# Altium project HIVE_SIGHT.PrjPcb (part 1 of 4)
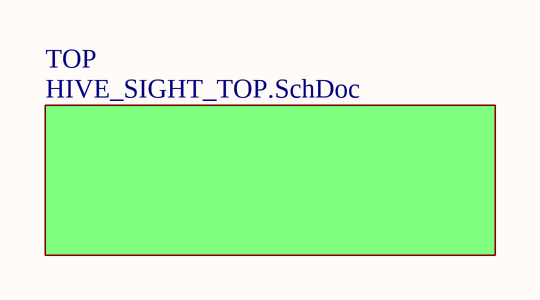
[diagram p0: HIVE_SIGHT_TITLE.SchDoc]
Project_Stencil_Top_Thickness: 0.1 MM; Project_Stencil_Bot_Thickness: 0.1 MM; Project_Revision: 1.000; Project_Name: HiveSight; Project_Group: SwarmUS; Project_Global: PMC; Project_Designer3: Louis-Daniel Gaulin; Project_Designer2: Hubert Dube; Project_Designer1: Philippe Arsenault; Project_Date: 2020-07-13
10 sheets, 273 parts. Net scope: hierarchical (ports join the sheet entries above them; power ports are global).
Board files: HIVE_SIGHT.PcbDoc, HIVE_SIGHT _PANEL.PcbDoc
Sheets:
  HIVE_SIGHT_TITLE.SchDoc
    TOP = HIVE_SIGHT_TOP.SchDoc
      POWER = HIVE_SIGHT_POWER.SchDoc
      USB = HIVE_SIGHT_USB.SchDoc
      DECAWAVE = HIVE_SIGHT_DECAWAVE_A.SchDoc
      WIRELESS = HIVE_SIGHT_WIRELESS.SchDoc
      DECAWAVE = HIVE_SIGHT_DECAWAVE_B.SchDoc
      MISC = HIVE_SIGHT_MISC.SchDoc
      NUCLEO = HIVE_SIGHT_NUCLEO.SchDoc
      WROOM = HIVE_SIGHT_WROOM.SchDoc

## Sheet HIVE_SIGHT_TITLE.SchDoc
size Tabloid; DocumentNumber: 1; SheetNumber: 2; SheetTotal: 6; Sheet_Name: Insert name in Document Parameters; Size: 11x17

### Sub-sheets
TOP = HIVE_SIGHT_TOP.SchDoc: no entries

### Notes on the sheet
- Revision history
- Package size conversion
- Metric
- 1005
- 1608
- Imperial
- 0402
- 0603
- Revision
- 2012
- 3216
- 0805
- 1206
- 3225
- 6432
- 1210
- 2512
- Date :
- Project Title
- Global Project
- Size
- Date
- Group
- Sheet
- of
- Filename
- Designers

## Sheet HIVE_SIGHT_TOP.SchDoc
size Tabloid; SheetNumber: 3; SheetTotal: 6; Sheet_Name: Top; Size: 11x17
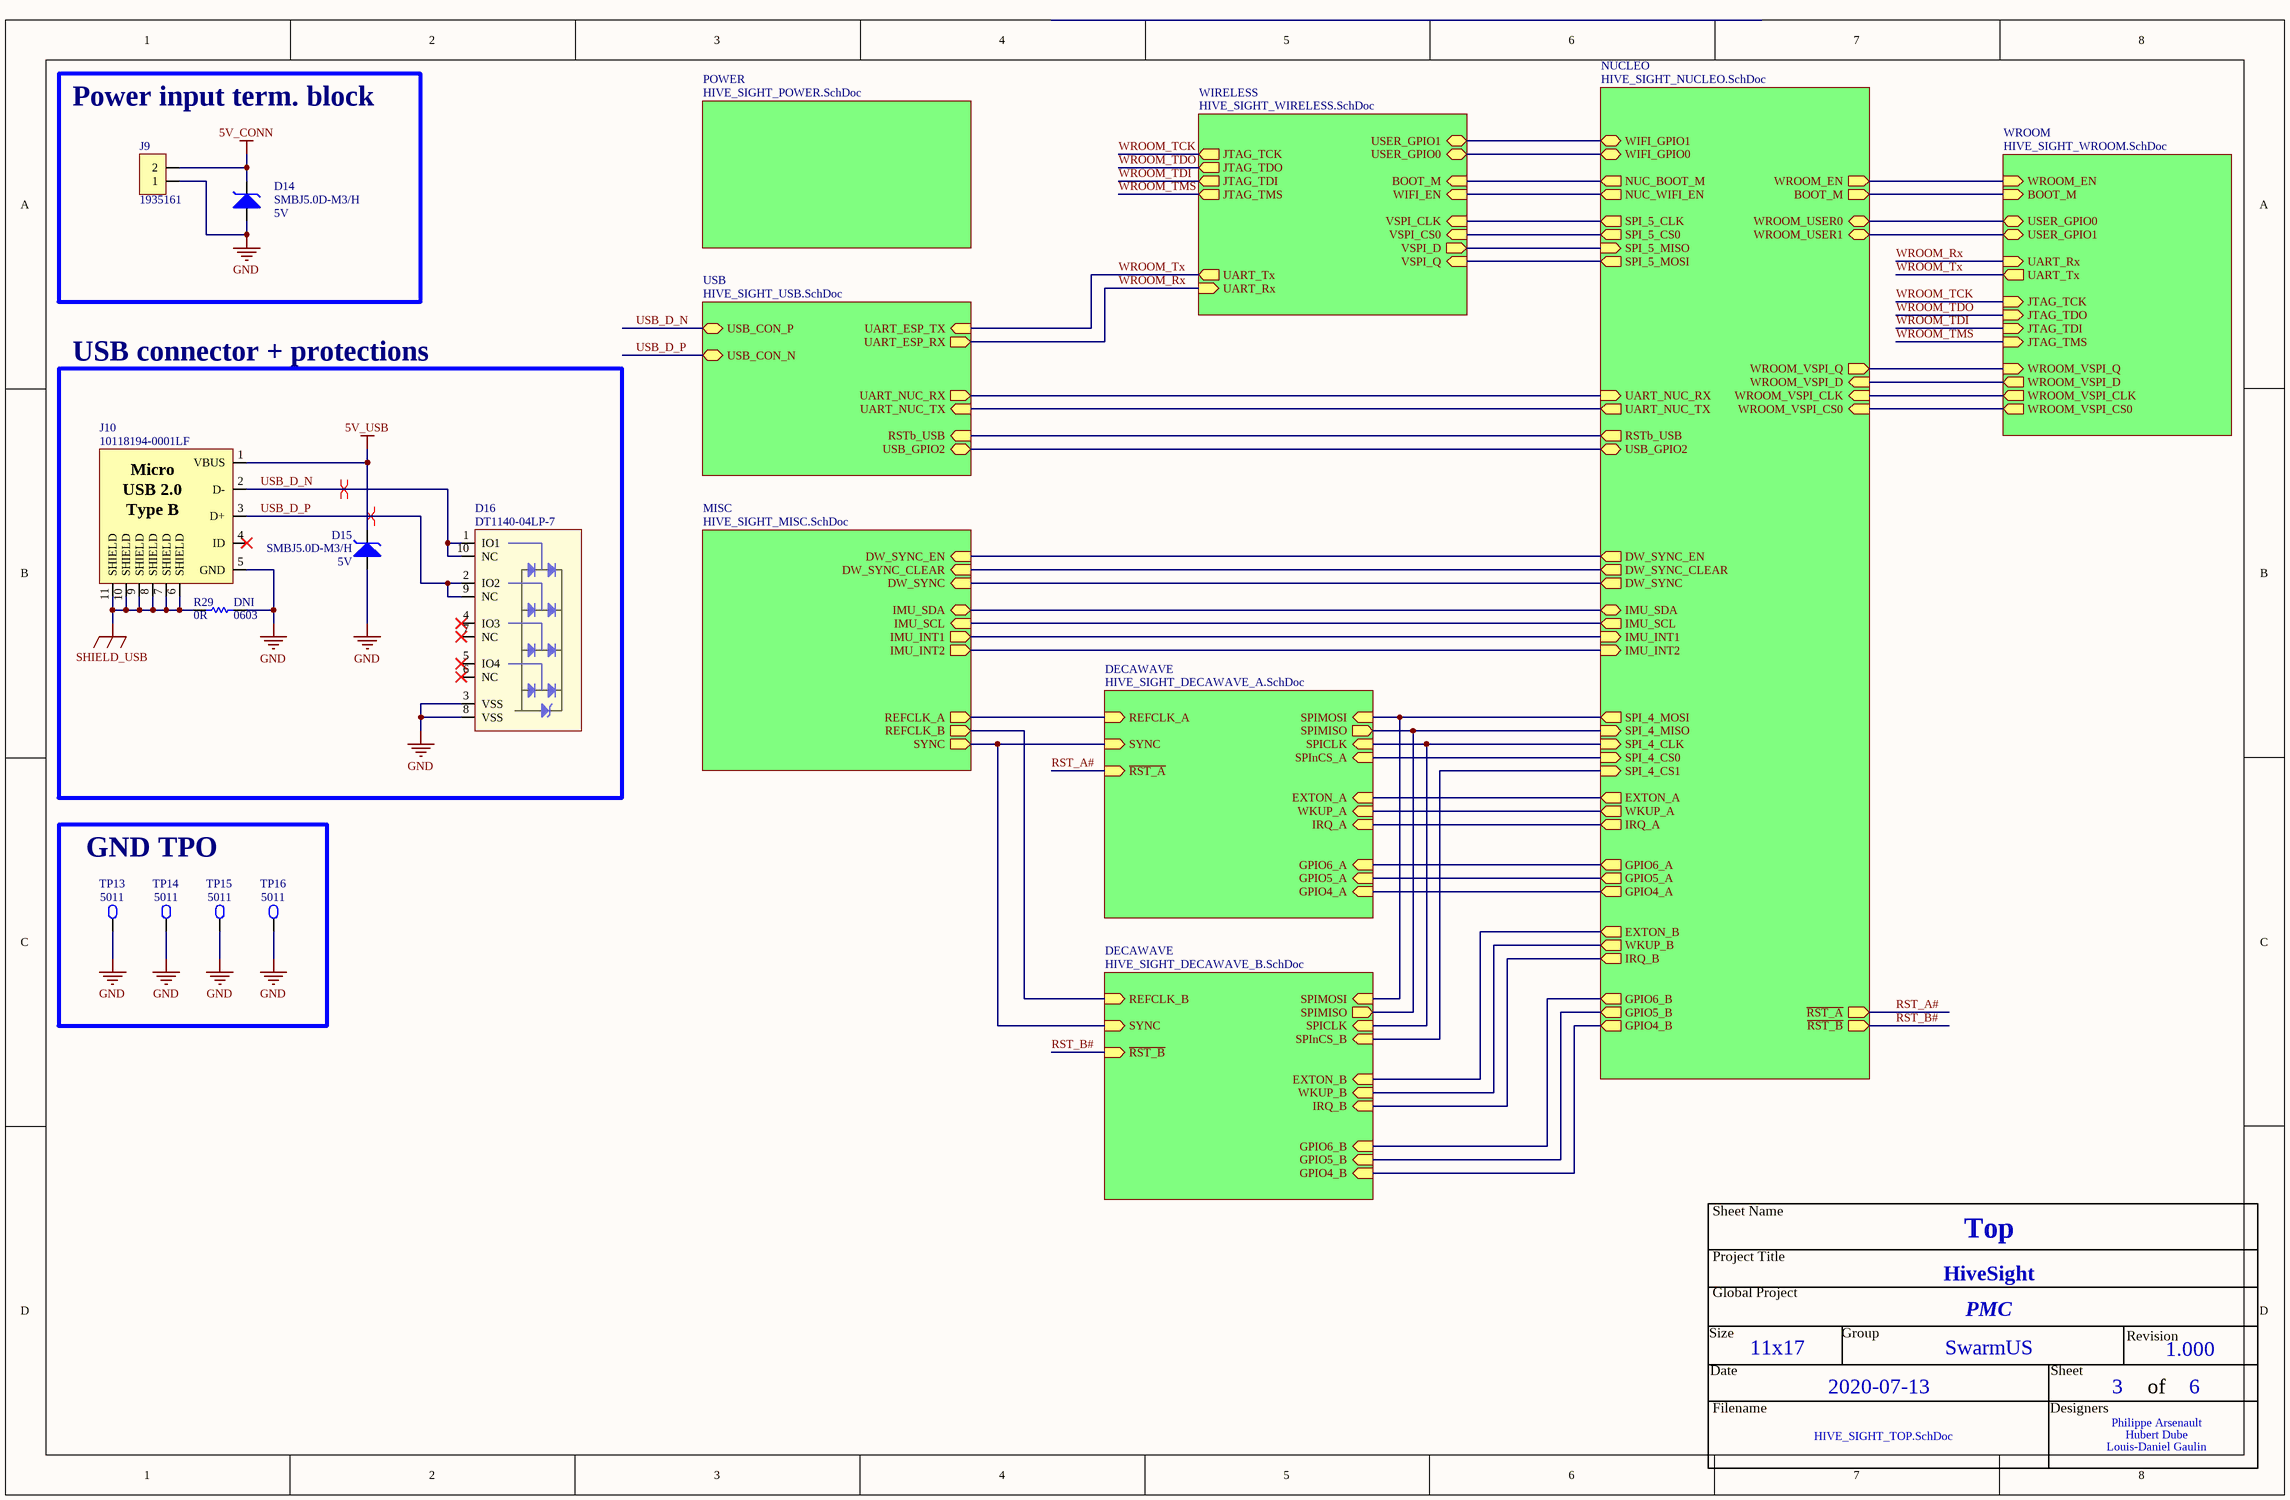
[diagram p1: HIVE_SIGHT_TOP.SchDoc]

### Parts
D14  SMBJ5.0D-M3/H  value 5V  [TVS_SMBJ5.0D-M3/H]
D15  SMBJ5.0D-M3/H  value 5V  [TVS_SMBJ5.0D-M3/H]
D16  DT1140-04LP-7  [TVS_DATA_DT1140-04LP-7]
J9  1935161  [CON_ 1935161]
J10  10118194-0001LF  [CON_USB_10118194-0001LF]
R29  value 0R  Assembly Note: DNI  Package: 0603  [RES_0603]  (hidden comment: RC0603JR-070RL)
TP13  5011  [TPO_5011]
TP14  5011  [TPO_5011]
TP15  5011  [TPO_5011]
TP16  5011  [TPO_5011]

### Blocks framed on the sheet
Power input term. block: D14 J9
USB connector + protections: D15 D16 J10 R29
GND TPO: TP13-TP16

### Sub-sheets
DECAWAVE = HIVE_SIGHT_DECAWAVE_A.SchDoc: SPInCS_A (in), SPIMOSI (in), SPIMISO (out), SPICLK (in), WKUP_A (in), IRQ_A (in), SYNC (in), REFCLK_A (in), ~{RST_A} (in), GPIO4_A (in), GPIO5_A (in), GPIO6_A (in), EXTON_A (in)
DECAWAVE = HIVE_SIGHT_DECAWAVE_B.SchDoc: SPInCS_B (in), SPIMOSI (in), SPICLK (in), WKUP_B (in), IRQ_B (in), REFCLK_B (in), ~{RST_B} (in), SYNC (in), GPIO4_B (in), GPIO5_B (in), GPIO6_B (in), EXTON_B (in), SPIMISO (out)
MISC = HIVE_SIGHT_MISC.SchDoc: IMU_INT2 (out), IMU_INT1 (out), IMU_SDA (bidir), IMU_SCL (in), REFCLK_A (out), REFCLK_B (out), SYNC (out), DW_SYNC_EN (in), DW_SYNC_CLEAR (in), DW_SYNC (in)
NUCLEO = HIVE_SIGHT_NUCLEO.SchDoc: IMU_INT2 (in), IMU_SDA (bidir), IMU_INT1 (in), IMU_SCL (out), SPI_4_CLK (in), SPI_4_CS1 (in), SPI_4_MOSI (out), SPI_4_CS0 (in), SPI_4_MISO (in), EXTON_A (out), WKUP_A (out), IRQ_A (out), GPIO6_A (out), GPIO5_A (out), GPIO4_A (out), EXTON_B (out), WKUP_B (out), IRQ_B (out), GPIO6_B (out), GPIO5_B (out), GPIO4_B (out), DW_SYNC_EN (out), DW_SYNC_CLEAR (out), DW_SYNC (out), ~{RST_A} (out), ~{RST_B} (out), UART_NUC_RX (in), UART_NUC_TX (out), RSTb_USB (out), USB_GPIO2 (bidir), SPI_5_MISO (in), SPI_5_CLK (out), SPI_5_CS0 (out), SPI_5_MOSI (out), NUC_BOOT_M (out), NUC_WIFI_EN (out), WIFI_GPIO1 (bidir), WIFI_GPIO0 (bidir), WROOM_EN (out), WROOM_VSPI_CS0 (in), WROOM_VSPI_CLK (in), WROOM_USER0 (bidir), WROOM_VSPI_D (in), WROOM_USER1 (bidir), BOOT_M (out), WROOM_VSPI_Q (out)
POWER = HIVE_SIGHT_POWER.SchDoc: no entries
USB = HIVE_SIGHT_USB.SchDoc: UART_NUC_TX (in), USB_CON_P (bidir), UART_ESP_TX (in), UART_NUC_RX (out), USB_CON_N (bidir), UART_ESP_RX (out), USB_GPIO2 (bidir), RSTb_USB (in)
WIRELESS = HIVE_SIGHT_WIRELESS.SchDoc: WIFI_EN (in), VSPI_CS0 (in), UART_Rx (in), VSPI_Q (in), VSPI_CLK (in), VSPI_D (out), BOOT_M (in), UART_Tx (out), USER_GPIO0 (bidir), USER_GPIO1 (bidir), JTAG_TMS (out), JTAG_TCK (out), JTAG_TDI (out), JTAG_TDO (out)
WROOM = HIVE_SIGHT_WROOM.SchDoc: WROOM_EN (in), WROOM_VSPI_CS0 (out), JTAG_TMS (in), WROOM_VSPI_CLK (out), JTAG_TCK (in), UART_Tx (out), JTAG_TDI (in), JTAG_TDO (in), USER_GPIO0 (bidir), WROOM_VSPI_D (out), USER_GPIO1 (bidir), UART_Rx (in), BOOT_M (in), WROOM_VSPI_Q (in)

### Nets
5V_CONN: D14.2(K) J9.2
5V_USB: D15.2(K) J10.1(VBUS)
GND: D14.1(A) D15.1(A) D16.3(VSS) D16.8(VSS) J9.1 J10.5(GND) R29.1 TP13.1 TP14.1 TP15.1 TP16.1
SHIELD_USB: J10.6(SHIELD) J10.7(SHIELD) J10.8(SHIELD) J10.9(SHIELD) J10.10(SHIELD) J10.11(SHIELD) R29.2
IMU_INT1: sheet MISC/IMU_INT1, sheet NUCLEO/IMU_INT1
IMU_INT2: sheet MISC/IMU_INT2, sheet NUCLEO/IMU_INT2
IMU_SCL: sheet MISC/IMU_SCL, sheet NUCLEO/IMU_SCL
IMU_SDA: sheet MISC/IMU_SDA, sheet NUCLEO/IMU_SDA
RST_A#: sheet DECAWAVE/~{RST_A}, sheet NUCLEO/~{RST_A}
RST_B#: sheet DECAWAVE/~{RST_B}, sheet NUCLEO/~{RST_B}
USB_D_N: D16.1(IO1) D16.10(NC) J10.2(D-) ; sheet USB/USB_CON_P
USB_D_P: D16.2(IO2) D16.9(NC) J10.3(D+) ; sheet USB/USB_CON_N
VSPI_CLK: sheet WIRELESS/VSPI_CLK, sheet NUCLEO/SPI_5_CLK
VSPI_CS0: sheet WIRELESS/VSPI_CS0, sheet NUCLEO/SPI_5_CS0
VSPI_D: sheet WIRELESS/VSPI_D, sheet NUCLEO/SPI_5_MISO
VSPI_Q: sheet WIRELESS/VSPI_Q, sheet NUCLEO/SPI_5_MOSI
WROOM_Rx: sheet USB/UART_ESP_RX, sheet WIRELESS/UART_Rx, sheet WROOM/UART_Rx
WROOM_TCK: sheet WIRELESS/JTAG_TCK, sheet WROOM/JTAG_TCK
WROOM_TDI: sheet WIRELESS/JTAG_TDI, sheet WROOM/JTAG_TDI
WROOM_TDO: sheet WIRELESS/JTAG_TDO, sheet WROOM/JTAG_TDO
WROOM_TMS: sheet WIRELESS/JTAG_TMS, sheet WROOM/JTAG_TMS
WROOM_Tx: sheet USB/UART_ESP_TX, sheet WIRELESS/UART_Tx, sheet WROOM/UART_Tx
NetC65_1: sheet DECAWAVE/REFCLK_A, sheet MISC/REFCLK_A
NetC66_1: sheet DECAWAVE/REFCLK_B, sheet MISC/REFCLK_B
NetR38_2: sheet WIRELESS/WIFI_EN, sheet NUCLEO/NUC_WIFI_EN
NetR40_2: sheet USB/RSTb_USB, sheet NUCLEO/RSTb_USB
NetR46_2: sheet NUCLEO/WROOM_EN, sheet WROOM/WROOM_EN
NetU3_21: sheet DECAWAVE/EXTON_A, sheet NUCLEO/EXTON_A
NetU3_23: sheet DECAWAVE/WKUP_A, sheet NUCLEO/WKUP_A
NetU3_24: sheet DECAWAVE/SPInCS_A, sheet NUCLEO/SPI_4_CS0
NetU3_29: sheet DECAWAVE/SYNC, sheet DECAWAVE/SYNC, sheet MISC/SYNC
NetU3_30: sheet DECAWAVE/GPIO6_A, sheet NUCLEO/GPIO6_A
NetU3_33: sheet DECAWAVE/GPIO5_A, sheet NUCLEO/GPIO5_A
NetU3_34: sheet DECAWAVE/GPIO4_A, sheet NUCLEO/GPIO4_A
NetU3_39: sheet DECAWAVE/SPIMOSI, sheet DECAWAVE/SPIMOSI, sheet NUCLEO/SPI_4_MOSI
NetU3_40: sheet DECAWAVE/SPIMISO, sheet DECAWAVE/SPIMISO, sheet NUCLEO/SPI_4_MISO
NetU3_41: sheet DECAWAVE/SPICLK, sheet DECAWAVE/SPICLK, sheet NUCLEO/SPI_4_CLK
NetU3_45: sheet DECAWAVE/IRQ_A, sheet NUCLEO/IRQ_A
NetU4_21: sheet DECAWAVE/EXTON_B, sheet NUCLEO/EXTON_B
NetU4_23: sheet DECAWAVE/WKUP_B, sheet NUCLEO/WKUP_B
NetU4_24: sheet DECAWAVE/SPInCS_B, sheet NUCLEO/SPI_4_CS1
NetU4_30: sheet DECAWAVE/GPIO6_B, sheet NUCLEO/GPIO6_B
NetU4_33: sheet DECAWAVE/GPIO5_B, sheet NUCLEO/GPIO5_B
NetU4_34: sheet DECAWAVE/GPIO4_B, sheet NUCLEO/GPIO4_B
NetU4_45: sheet DECAWAVE/IRQ_B, sheet NUCLEO/IRQ_B
NetU6_2: sheet MISC/DW_SYNC_EN, sheet NUCLEO/DW_SYNC_EN
NetU7_3: sheet MISC/DW_SYNC, sheet NUCLEO/DW_SYNC
NetU7_6: sheet MISC/DW_SYNC_CLEAR, sheet NUCLEO/DW_SYNC_CLEAR
NetU9_16: sheet WIRELESS/USER_GPIO1, sheet NUCLEO/WIFI_GPIO1
NetU9_23: sheet WIRELESS/BOOT_M, sheet NUCLEO/NUC_BOOT_M
NetU9_27: sheet WIRELESS/USER_GPIO0, sheet NUCLEO/WIFI_GPIO0
NetU11_12: sheet USB/USB_GPIO2, sheet NUCLEO/USB_GPIO2
NetU12_3: sheet USB/UART_NUC_RX, sheet NUCLEO/UART_NUC_RX
NetU12_7: sheet USB/UART_NUC_TX, sheet NUCLEO/UART_NUC_TX
NetU13_CN7-17: sheet NUCLEO/WROOM_VSPI_CS0, sheet WROOM/WROOM_VSPI_CS0
NetU13_CN8-6: sheet NUCLEO/WROOM_VSPI_CLK, sheet WROOM/WROOM_VSPI_CLK
NetU13_CN8-8: sheet NUCLEO/WROOM_VSPI_Q, sheet WROOM/WROOM_VSPI_Q
NetU13_CN8-10: sheet NUCLEO/WROOM_VSPI_D, sheet WROOM/WROOM_VSPI_D
NetU13_CN9-1: sheet NUCLEO/WROOM_USER1, sheet WROOM/USER_GPIO1
NetU13_CN9-2: sheet NUCLEO/BOOT_M, sheet WROOM/BOOT_M
NetU13_CN9-3: sheet NUCLEO/WROOM_USER0, sheet WROOM/USER_GPIO0

Not connected (* = marked no-connect by the designer): D16 4(IO3)* 5(IO4)* 6(NC)* 7(NC)*; J10 4(ID)*

### Layout directives
differential pair: USB_D_N, USB_D_P

### Notes on the sheet
- Sheet Name
- Project Title
- Global Project
- Revision
- Size
- Date
- Group
- Sheet
- of
- Filename
- Designers
- (in symbol CON_USB_10118194-0001LF) Micro; USB 2.0; Type B

### Library data of the parts
D14 D15 = TVS_SMBJ5.0D-M3/H: TVS - DIODE 5V 9.1V- DO-214AA; Manufacturer #1: Vishay Semiconductor Diodes Division; Current Rating: 65.9A peak pulse; GRAMS Lib Spec: 2.8c; Magnetic Material: Unknown; Polarized: Yes; Power Max: 600W peak pulse; Voltage Rating: Vbr = 6.5, Vc = 9.1; CreatedBy/Date: Louis-Daniel Gaulin / 27-02-2020; HelpURL: http://www.vishay.com/docs/87606/87606.pdf; Manufacturer #2: *; Package: DO-214AA; Part Number #1: SMBJ5.0D-M3/H; Part Number #2: *; Supplier 1: Digi-Key; Supplier Part Number 1: SMBJ5.0D-M3/HGICT-ND; Temperature: -55°C ~ 150°C; Tolerance: *; VerifiedBy: C.Paulin - 09/03/2020; Assembly Type: SMD
D16 = TVS_DATA_DT1140-04LP-7: TVS - DIODE 5.5V 10V - 10-UFDFN; Manufacturer #1: Diodes Incorporated; Value: 5.5V @ 1mA (Reverse Standoff); Voltage Rating: 6V (Breakdown); Current Rating: 6A (8/20µs); Power Max: 60W (8/20µs); GRAMS Lib Spec: 2.8; Note: Fooprint created from tpd4e05u06 (TI) for manufacturability (soldermask); Magnetic Material: Unknown; Polarized: Yes; Tolerance: -; HelpURL: https://www.diodes.com/assets/Datasheets/DT1140-04LP.pdf; CreatedBy/Date: Joël Lemay 2019-11-20; VerifiedBy: C.Paulin - 21/11/2019; Temperature: -55°C~85°C; Package: 10-UFDFN; Manufacturer #2: -; Assembly Type: SMD; Part Number #2: -; Part Number #1: DT1140-04LP-7; Supplier 1: Digi-Key; Supplier Part Number 1: DT1140-04LP-7DICT-ND; Cryo: UNKNOWN
J9 = CON_1935161: CON - TERM BLK 2POS SIDE ENTRY 5MM PCB - TH - 14-26 AWG; Manufacturer #1: Phoenix Contact; Current Rating: 17.5A; Magnetic Material: Unknown; Polarized: Yes; Voltage Rating: 400V; GRAMS Lib Spec: 2.8; Assembly Type: TH; Manufacturer #2: *; Note: *; Part Number #1: 1935161; Part Number #2: *; Package: TH; Power Max: *; Value: *; Temperature: -40 °C ~ 100 °C; HelpURL: https://media.digikey.com/pdf/Data%20Sheets/Phoenix%20Contact%20PDFs/1935161.pdf; CreatedBy/Date: Louis-Daniel Gaulin / 02-11-2020; Supplier 1: Digi-Key; Supplier Part Number 1: 277-1667-ND; Tolerance: *; VerifiedBy: Philippe Arsenault/2020-11-06; Cryo: UNKNOWN
J10 = CON_USB_10118194-0001LF: CON - USB MICRO B RECPT SMT R/A - 4PIN; Manufacturer #1: Amphenol FCI; Value: USB - Micro B; Voltage Rating: 100VAC; Current Rating: 1.8A; GRAMS Lib Spec: 2.8; Magnetic Material: YES; Tolerance: *; Power Max: *; HelpURL: https://cdn.amphenol-icc.com/media/wysiwyg/files/drawing/10118194.pdf; CreatedBy/Date: Arnaud Samson - 09/07/18; VerifiedBy: Jonathan Bouchard 2018-07-12; Temperature: -30°C ~ 80°C; Package: 5-SMD; Manufacturer #2: *; Note: *; Assembly Type: SMD; Part Number #2: *; Part Number #1: 10118194-0001LF; Polarized: YES; Supplier 1: Digi-Key; Supplier Part Number 1: 609-4618-1-ND
R29 = RES_RC0603JR-070RL: RES - 0 ohm jumper 1/10W - 0603; Manufacturer #1: Yageo; GRAMS Lib Spec: 2.8; Magnetic Material: Unknown; Polarized: No; Assembly Type: SMD; CreatedBy/Date: L-P Gauthier 2018-10-30; Current Rating: *; HelpURL: http://www.yageo.com/documents/recent/PYu-RC_Group_51_RoHS_L_9.pdf; Manufacturer #2: *; Part Number #1: RC0603JR-070RL; Part Number #2: *; Power Max: 1/10W; Temperature: -55°C ~ 155°C; VerifiedBy: Caroline Paulin  - 5/11/2018; Voltage Rating: -; Supplier 1: Digi-Key; Supplier Part Number 1: 311-0.0GRCT-ND
TP13-TP16 = TPO_5011: TPO - TEST POINT - TH; Manufacturer #1: Keystone Electronics; Polarized: No; Magnetic Material: UNKNOWN; GRAMS Lib Spec: 2.8; Current Rating: *; Manufacturer #2: *; Note: *; Power Max: *; Value: *; Part Number #1: 5011; Part Number #2: *; HelpURL: https://www.keyelco.com/userAssets/file/M65p56.pdf; Assembly Type: TH; Package: *; CreatedBy/Date: Louis-Daniel Gauli / 02-11-2020; Temperature: *; Tolerance: *; VerifiedBy: Philippe Arsenault/2020-11-06; Voltage Rating: *; Cryo: UNKNOWN; Supplier 1: Digi-Key

## Sheet HIVE_SIGHT_POWER.SchDoc
size Tabloid; SheetNumber: 1; SheetTotal: 6; Sheet_Name: POWER; Size: 11x17
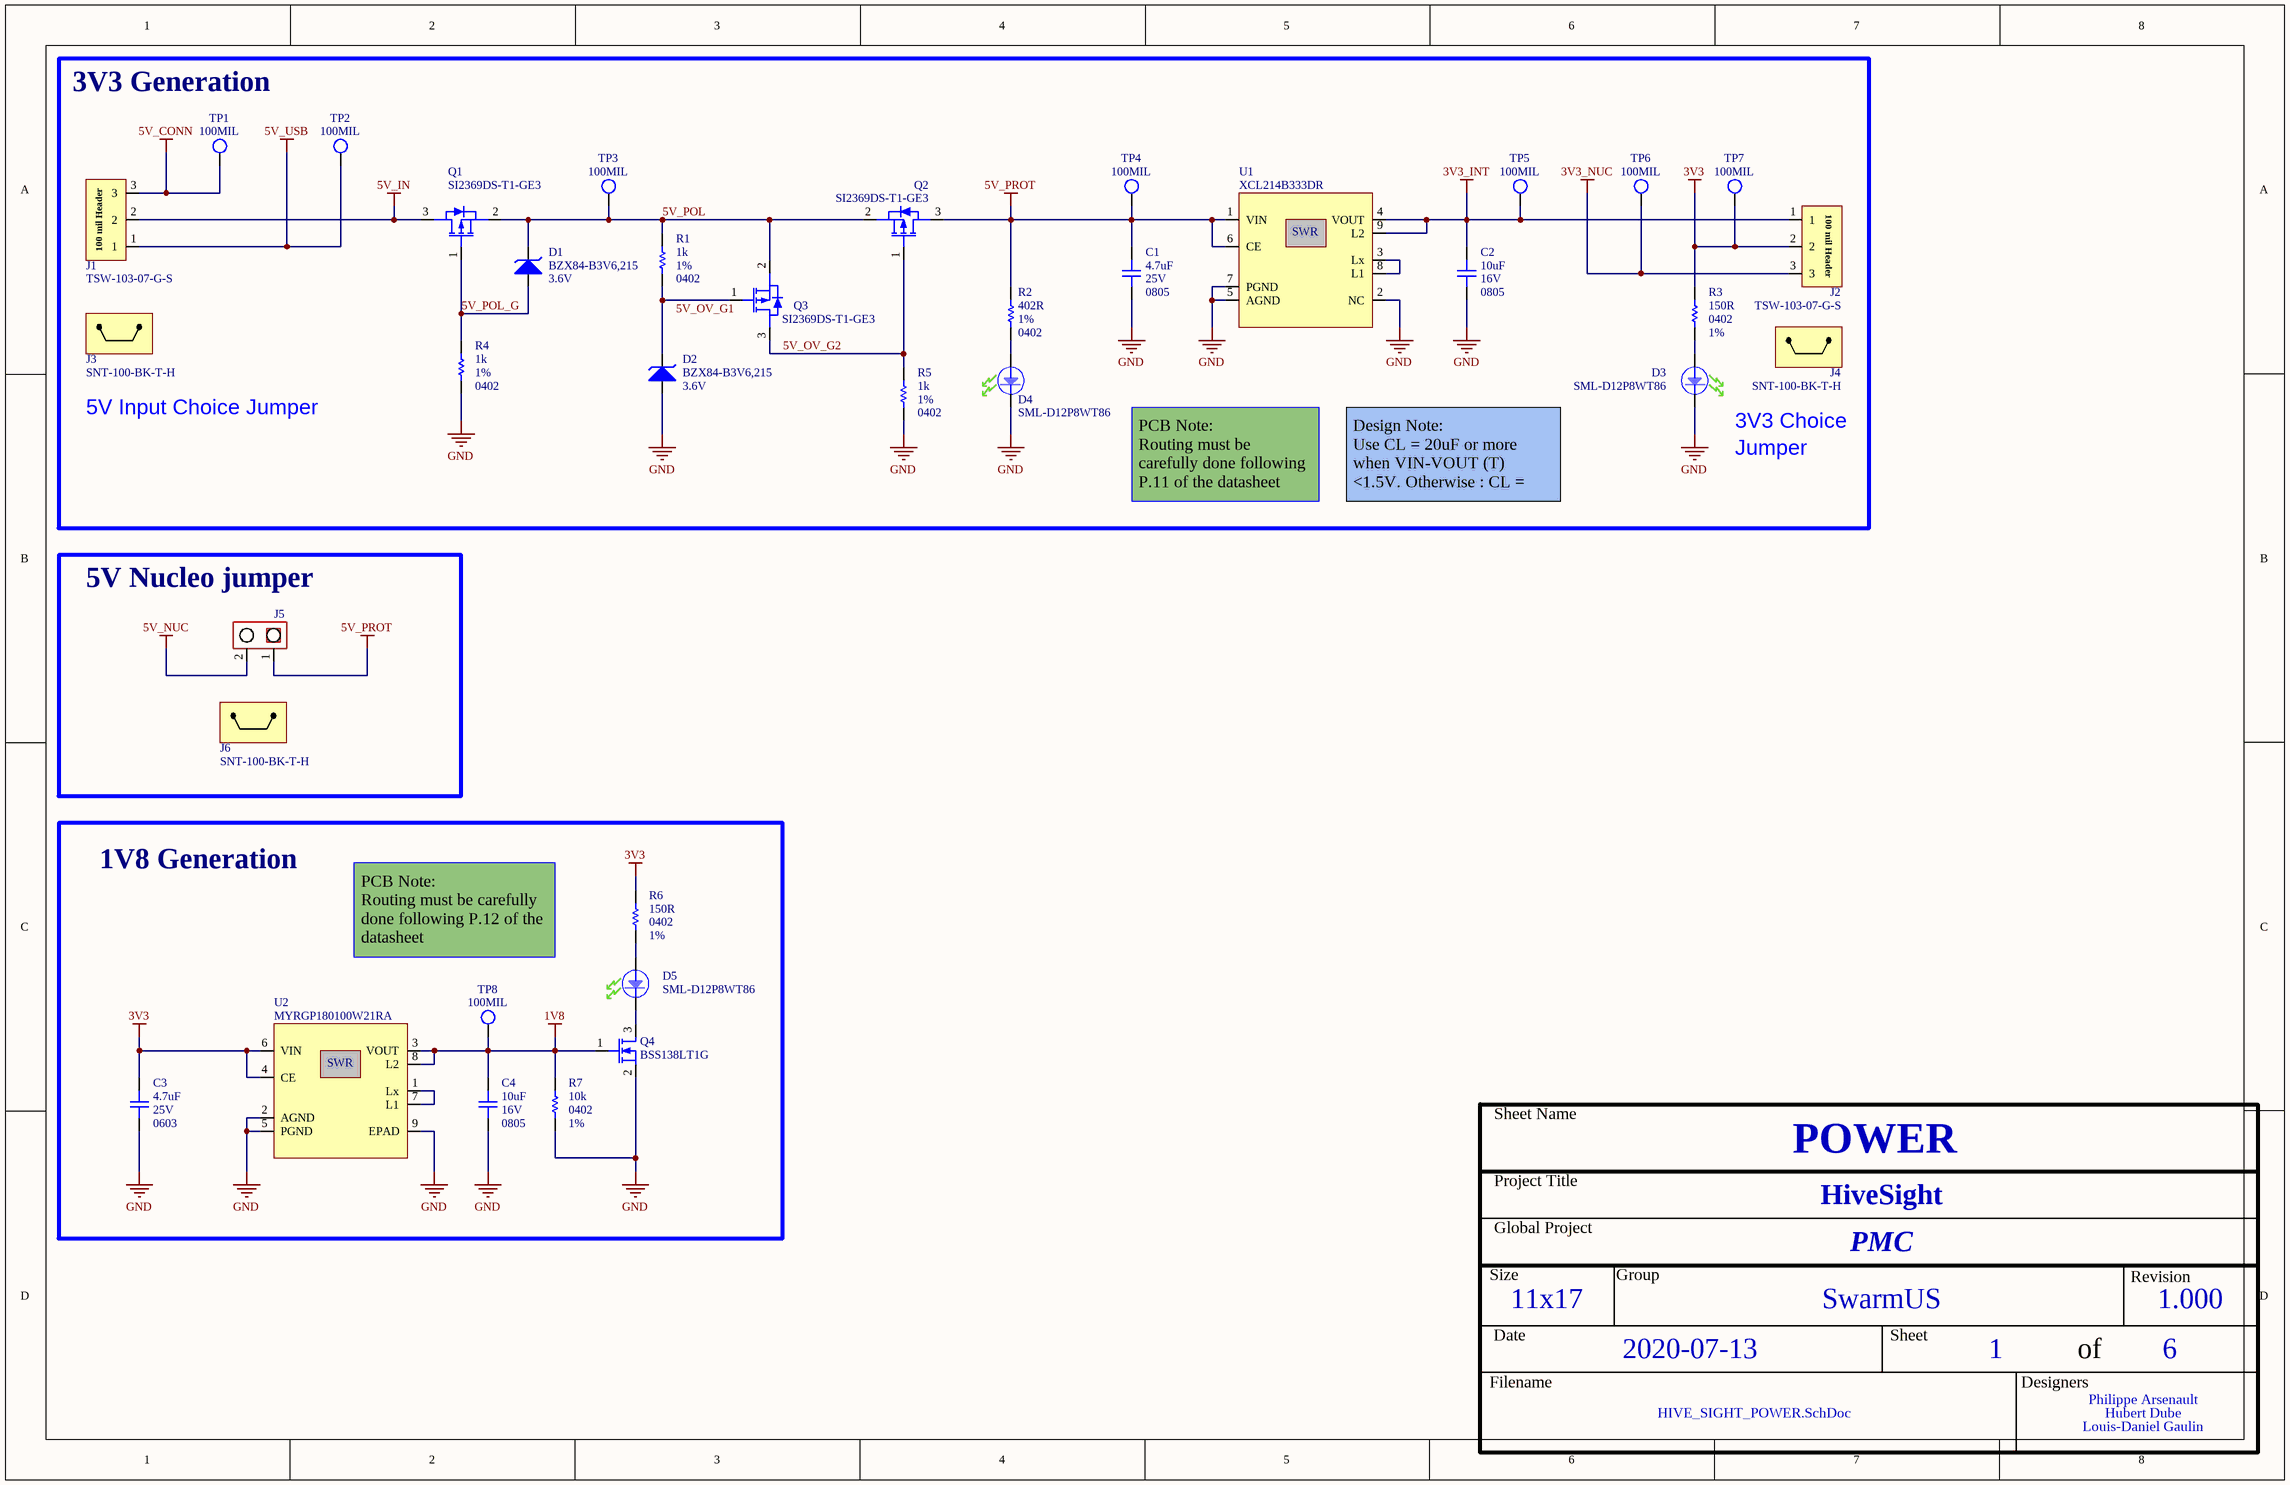
[diagram p2: HIVE_SIGHT_POWER.SchDoc]

### Parts
C1  value 4.7uF  Package: 0805  Voltage Rating: 25V  [CAP_CER_0805]  (hidden comment: C2012X7R1E475K125AE)
C2  value 10uF  Package: 0805  Voltage Rating: 16V  [CAP_CER_0805]  (hidden comment: GRM21BR61C106KE15K)
C3  value 4.7uF  Package: 0603  Voltage Rating: 25V  [CAP_CER_0603]  (hidden comment: CL10A475MA8NQNC)
C4  value 10uF  Package: 0805  Voltage Rating: 16V  [CAP_CER_0805]  (hidden comment: GRM21BR61C106KE15K)
D1  BZX84-B3V6,215  value 3.6V  [DIO_ZENER_BZX84-B3V6,215]
D2  BZX84-B3V6,215  value 3.6V  [DIO_ZENER_BZX84-B3V6,215]
D3  SML-D12P8WT86  [LED_SML-D12P8WT86]
D4  SML-D12P8WT86  [LED_SML-D12P8WT86]
D5  SML-D12P8WT86  [LED_SML-D12P8WT86]
J1  TSW-103-07-G-S  [CON_HDR_TSW-103-07-G-S]
J2  TSW-103-07-G-S  [CON_HDR_TSW-103-07-G-S]
J3  SNT-100-BK-T-H  [CON_JMP_SNT-100-BK-T-H]
J4  SNT-100-BK-T-H  [CON_JMP_SNT-100-BK-T-H]
J5  CON_HDR_1x2  [CON_HDR_1X2]  (value not drawn)
J6  SNT-100-BK-T-H  [CON_JMP_SNT-100-BK-T-H]
Q1  SI2369DS-T1-GE3  [TRX_PMOS_SI2369DS-T1-GE3]
Q2  SI2369DS-T1-GE3  [TRX_PMOS_SI2369DS-T1-GE3]
Q3  SI2369DS-T1-GE3  [TRX_PMOS_SI2369DS-T1-GE3]
Q4  BSS138LT1G  [TRX_NMOS_BSS138LT1G]
R1  value 1k  Tolerance: 1%  Package: 0402  [RES_0402]  (hidden comment: RC0402FR-071KL)
R2  value 402R  Tolerance: 1%  Package: 0402  [RES_0402]  (hidden comment: ERJ-2RKF4020X)
R3  value 150R  Tolerance: 1%  Package: 0402  [RES_0402]  (hidden comment: RC0402FR-07150RL)
R4  value 1k  Tolerance: 1%  Package: 0402  [RES_0402]  (hidden comment: RC0402FR-071KL)
R5  value 1k  Tolerance: 1%  Package: 0402  [RES_0402]  (hidden comment: RC0402FR-071KL)
R6  value 150R  Tolerance: 1%  Package: 0402  [RES_0402]  (hidden comment: RC0402FR-07150RL)
R7  value 10k  Tolerance: 1%  Package: 0402  [RES_0402]  (hidden comment: RC0402FR-0710KL)
TP1  100MIL  [TPO_TH_ROUND_100MIL]  (no BOM)
TP2  100MIL  [TPO_TH_ROUND_100MIL]  (no BOM)
TP3  100MIL  [TPO_TH_ROUND_100MIL]  (no BOM)
TP4  100MIL  [TPO_TH_ROUND_100MIL]  (no BOM)
TP5  100MIL  [TPO_TH_ROUND_100MIL]  (no BOM)
TP6  100MIL  [TPO_TH_ROUND_100MIL]  (no BOM)
TP7  100MIL  [TPO_TH_ROUND_100MIL]  (no BOM)
TP8  100MIL  [TPO_TH_ROUND_100MIL]  (no BOM)
U1  XCL214B333DR  [REG_SWR_XCL214B333DR]
U2  MYRGP180100W21RA  [REG_SWR_MYRGP180100W21RA]

### Blocks framed on the sheet
3V3 Generation: C1 C2 D1-D4 J1-J4 Q1-Q3 R1-R5 TP1-TP7 U1
5V Nucleo jumper: J5 J6
1V8 Generation: C3 C4 D5 Q4 R6 R7 TP8 U2

### Nets
1V8: C4.2 Q4.1(G) R7.1 TP8.1 U2.3(VOUT) U2.8(L2)
3V3: C3.2 J2.2 R3.1 R6.1 TP7.1 U2.4(CE) U2.6(VIN)
3V3_INT: C2.2 J2.1 TP5.1 U1.4(VOUT) U1.9(L2)
3V3_NUC: J2.3 TP6.1
5V_CONN: J1.3 TP1.1
5V_IN: J1.2 Q1.3(D)
5V_NUC: J5.2
5V_PROT: C1.2 J5.1 Q2.3(D) R2.2 TP4.1 U1.1(VIN) U1.6(CE)
5V_USB: J1.1 TP2.1
GND: C1.1 C2.1 C3.1 C4.1 D2.1(A) D3.K D4.K Q4.2(S) R4.2 R5.2 R7.2 U1.2(NC) U1.5(AGND) U1.7(PGND) U2.2(AGND) U2.5(PGND) U2.9(EPAD)
5V_OV_G1: D2.3(K) Q3.1(G) R1.2
5V_OV_G2: Q2.1(G) Q3.3(D) R5.1
5V_POL: D1.3(K) Q1.2(S) Q2.2(S) Q3.2(S) R1.1 TP3.1
5V_POL_G: D1.1(A) Q1.1(G) R4.1
NetD3_A: D3.A R3.2
NetD4_A: D4.A R2.1
NetD5_A: D5.A R6.2
NetD5_K: D5.K Q4.3(D)
NetU1_3: U1.3(Lx) U1.8(L1)
NetU2_1: U2.1(Lx) U2.7(L1)

Not connected (* = marked no-connect by the designer): D1 2(NC); D2 2(NC)

### Notes on the sheet
- 5V Input Choice Jumper
- (near D3) 3V3 Choice
- PCB Note:
  Routing must be carefully done following P.11 of the datasheet
- Design Note:
  Use CL = 20uF or more when VIN-VOUT (T) <1.5V. Otherwise : CL = 10uF
- Jumper
- PCB Note:
  Routing must be carefully done following P.12 of the datasheet
- Sheet Name
- Project Title
- Global Project
- Size
- Group
- Revision
- Date
- Sheet
- of
- Filename
- Designers
- (in symbol CON_HDR_TSW-103-07-G-S) 100 mil Header
- (in symbol REG_SWR_MYRGP180100W21RA) SWR
- (in symbol REG_SWR_XCL214B333DR) SWR

### Library data of the parts
C1 = CAP_CER_C2012X7R1E475K125AE: CAP - CER 4.7UF 10% 25V X7R - 0805; Manufacturer #1: TDK Corporation; GRAMS Lib Spec: 2.8; Magnetic Material: Unknown; Polarized: No; Tolerance: 10%; Current Rating: *; Power Max: *; HelpURL: https://product.tdk.com/info/en/documents/chara_sheet/C2012X7R1E475K125AE.pdf; CreatedBy/Date: Keven Deslandes - 2018/11/09; VerifiedBy: Nicolas Roy - 2018/12/11; Temperature: -55°C ~ 125°C; Manufacturer #2: *; Note: *; Assembly Type: SMD; Part Number #2: *; Part Number #1: C2012X7R1E475K125AE; Supplier 1: Digi-Key; Supplier Part Number 1: 445-14537-1-ND
C2 C4 = CAP_CER_GRM21BR61C106KE15K: CAP - CER 10UF 10% 16V X5R - 0805; Manufacturer #1: Murata; GRAMS Lib Spec: 2.8; Magnetic Material: Unknown; Polarized: NO; Assembly Type: SMD; CreatedBy/Date: Caroline Paulin / 8 août 2018; Current Rating: *; HelpURL: https://search.murata.co.jp/Ceramy/image/img/A01X/G101/ENG/GRM21BR61C106KE15-01.pdf; Manufacturer #2: *; Note: *; Part Number #1: GRM21BR61C106KE15K; Part Number #2: *; Power Max: *; Temperature: -55°C ~ 85°C; Tolerance: 10%; VerifiedBy: Nicolas V. (2019-01-22); Supplier 1: Digi-Key; Supplier Part Number 1: 490-6473-1-ND
C3 = CAP_CER_CL10A475MA8NQNC: CAP - CER 4.7µF 20% 25V X5R - 0603; Manufacturer #1: Samsung Electro-Mechanics; GRAMS Lib Spec: 2.8; Magnetic Material: Unknown; Polarized: NO; Assembly Type: SMD; CreatedBy/Date: Nicolas Roy 2018-11-21; Current Rating: *; HelpURL: http://www.samsungsem.com/kr/support/product-search/mlcc/__icsFiles/afieldfile/2018/06/20/CL10A475MA8NQNC.pdf; Manufacturer #2: *; Note: *; Part Number #1: CL10A475MA8NQNC; Part Number #2: *; Power Max: *; Temperature: -55°C ~ 85°C; Tolerance: 20%; VerifiedBy: Nicolas V. (2019-01-22); Supplier 1: Digi-Key; Supplier Part Number 1: 1276-1903-1-ND
D1 D2 = DIO_ZENER_BZX84-B3V6,215: DIO - ZENER 3.6V 250mW - SOT-23; Manufacturer #1: Nexperia USA Inc.; Current Rating: 70mA; GRAMS Lib Spec: 2.8; Magnetic Material: Unknown; Polarized: Yes; Tolerance: 2%; Assembly Type: SMD; CreatedBy/Date: Louis-Daniel Gaulin / 30-07-2020; HelpURL: https://assets.nexperia.com/documents/data-sheet/BZX84_SER.pdf; Manufacturer #2: -; Note: -; Package: SOT-23; Part Number #1: BZX84-B3V6,215; Part Number #2: -; Power Max: 250mW; Temperature: -65°C ~ 150°C; VerifiedBy: Philippe Arsenault/2020-11-06; Voltage Rating: 3.6V; Supplier 1: Digi-Key; Supplier Part Number 1: 1727-6252-1-ND; Cryo: UNKNOWN
D3-D5 = LED_SML-D12P8WT86: LED - GREEN DIFFUSED 0603 SMD - 0603; Manufacturer #1: Rohm Semiconductor; Current Rating: 1-20mA; Note: Operate at 2mA; Value: 560 nm (green); Voltage rating: 2.2V (Forward), 5V (max Reverse); Polarized: Yes; Magnetic Material: Unknown; GRAMS Lib Spec: 2.8; Manufacturer #2: *; Power Max: *; Part Number #1: SML-D12P8WT86; Part Number #2: *; HelpURL: https://d1d2qsbl8m0m72.cloudfront.net/en/products/databook/datasheet/opto/led/chip_mono/sml-d12x8_d13x8-e.pdf; Supplier 1: Digi-Key; Supplier Part Number 1: 511-1579-2-ND; Assembly Type: SMD; Temperature: -40 ~ 85 °C; Package: 0603; CreatedBy/Date: Keven Deslandes - 2018/11/21; Tolerance: *; VerifiedBy: Caroline Paulin - 13 février 2019; Cryo: UNKNOWN
J1 J2 = CON_HDR_TSW-103-07-G-S: CON - HDR 100 MIL 3 POS - TH; Manufacturer #1: Samtec; Value: 3 POS; Voltage Rating: 400-550 VAC; Current Rating: 4.3-6.3A; GRAMS Lib Spec: 2.8; Magnetic Material: YES; Polarized: NO; Tolerance: *; Power Max: *; HelpURL: http://suddendocs.samtec.com/catalog_english/tsw_th.pdf; CreatedBy/Date: Jonathan Bouchard; VerifiedBy: Arnaud Samson 16-07-18; Temperature: -55 °C to +125 °C; Package: 3-TH; Manufacturer #2: *; Note: *; Assembly Type: TH; Part Number #2: *; Part Number #1: TSW-103-07-G-S; Supplier 1: Samtec; Supplier Part Number 1: TSW-103-07-G-S
J3 J4 J6 = CON_JMP_SNT-100-BK-T-H: CON - CONN SHUNT - MEC; Manufacturer #1: Samtec Inc.; Voltage Rating: 450 VAC; Current Rating: 4.3A; GRAMS Lib Spec: 2.8; Magnetic Material: UNKNOWN; Polarized: NO; Value: *; Tolerance: *; Power Max: *; HelpURL: http://suddendocs.samtec.com/catalog_english/snt.pdf; CreatedBy/Date: Arnaud Samson - 09/07/18; VerifiedBy: Jonathan Bouchard 2018-07-12; Temperature: -55 °C to +125 °C; Package: MEC; Manufacturer #2: *; Note: *; Assembly Type: MANUAL; Part Number #2: *; Part Number #1: SNT-100-BK-T-H; Supplier 1: Digi-Key; Supplier Part Number 1: SAM8972-ND
J5 = CON_HDR_1X2: CON - Header 1x2 pins 100 mil -TH; Polarized: No; Magnetic Material: UNKNOWN; GRAMS Lib Spec: 2.8; Manufacturer #1: *; Current Rating: *; Power Max: *; Voltage Rating: *; Manufacturer #2: *; Note: *; Part Number #2: *; HelpURL: *; Package: TH; Assembly Type: TH; Temperature: *; CreatedBy/Date: Nicolas Roy/2 dec 2016; Tolerance: *; VerifiedBy: Caroline Paulin / 10 juillet 2018
Q1-Q3 = TRX_PMOS_SI2369DS-T1-GE3: TRX - PMOS 30V 7.6A - SOT−23; Manufacturer #1: Vishay Siliconix; GRAMS Lib Spec: 2.8; Magnetic Material: Unknown; Polarized: Yes; Power Max: 1.25W; Assembly Type: SMD; CreatedBy/Date: Louis-Daniel Gaulin / 30-07-2020; Current Rating: 7.6A; HelpURL: https://www.vishay.com/docs/62865/si2369d.pdf; Manufacturer #2: *; Package: SOT-23; Part Number #1: SI2369DS-T1-GE3; Part Number #2: *; Supplier 1: Digi-Key; Supplier Part Number 1: SI2369DS-T1-GE3CT-ND; Temperature: -55°C ~ 150°C; Tolerance: *; Value: *; VerifiedBy: Philippe Arsenault/2020-11-06; Voltage Rating: 30V; Cryo: UNKNOWN
Q4 = TRX_NMOS_BSS138LT1G: TRX - NMOS - 50V 200MA - SOT−23-3; Manufacturer #1: ON Semiconductor; GRAMS Lib Spec: 2.8; Magnetic Material: Unknown; Polarized: Yes; Power Max: 225mW; Assembly Type: SMD; CreatedBy/Date: Joel Lemay 2018-06-15; Current Rating: 200mA; HelpURL: http://www.onsemi.com/pub/Collateral/BSS138LT1-D.PDF; Manufacturer #2: *; Package: SOT-23-3; Part Number #1: BSS138LT1G; Part Number #2: *; Supplier 1: Digi-Key; Supplier Part Number 1: BSS138LT1GOSCT-ND; Temperature: -55°C ~ 150°C; Tolerance: *; Value: *; VerifiedBy: Caroline Paulin - 6 sept 2018; Voltage Rating: 50V
R1 R4 R5 = RES_RC0402FR-071KL: RES - 1K OHM 1% 1/16W - 0402; Manufacturer #1: Yageo; GRAMS Lib Spec: 2.8; Magnetic Material: YES; Polarized: NO; Voltage Rating: 50V; Cryo: UNKNOWN; Assembly Type: SMD; CreatedBy/Date: Jonathan Bouchard 2018-07-05; Current Rating: *; HelpURL: http://www.yageo.com/documents/recent/PYu-RC_Group_51_RoHS_L_9.pdf; Manufacturer #2: *; Note: *; Part Number #1: RC0402FR-071KL; Part Number #2: *; Power Max: 1/16W; Temperature: -55°C ~ 155°C; VerifiedBy: Arnaud Samson 16-07-18; Supplier 1: Digi-Key; Supplier Part Number 1: 311-1.00KLRCT-ND
R2 = RES_ERJ-2RKF4020X: RES - 402R 1% 1/10W - 0402; Manufacturer #1: Panasonic Electronic Components; GRAMS Lib Spec: 2.8; Magnetic Material: Unknown; Polarized: No; Voltage Rating: 50V; Assembly Type: SMD; CreatedBy/Date: Keven Deslandes 2018-09-20; Current Rating: *; HelpURL: https://industrial.panasonic.com/ww/products/resistors/chip-resistors/general-purpose-chip-resistors/precision-thick-film-chip-resistors/ERJ2RKF4020X; Manufacturer #2: *; Part Number #1: ERJ-2RKF4020X; Part Number #2: *; Power Max: 1/10W; Temperature: -55°C ~ 155°C; VerifiedBy: Caroline Paulin - 18/12/2018; Supplier 1: Digi-Key; Supplier Part Number 1: P402LCT-ND
R3 R6 = RES_RC0402FR-07150RL: RES - 150R 1% 1/16W - 0402; Manufacturer #1: Yageo; GRAMS Lib Spec: 2.8; Magnetic Material: Unknown; Polarized: No; Voltage Rating: 50V; Assembly Type: SMD; CreatedBy/Date: Jonathan Bouchard 2019-03-25; Current Rating: *; HelpURL: http://www.yageo.com/documents/recent/PYu-RC_Group_51_RoHS_L_10.pdf; Manufacturer #2: *; Part Number #1: RC0402FR-07150RL; Part Number #2: *; Power Max: 1/16W; Temperature: -55°C ~ 155°C; VerifiedBy: Nicolas V. (2019-05-02); Supplier 1: Digi-Key; Supplier Part Number 1: 311-150LRCT-ND; Cryo: UNKNOWN
R7 = RES_RC0402FR-0710KL: RES - 10K OHMS 1% 1/16W - 0402; Manufacturer #1: Yageo; GRAMS Lib Spec: 2.8; Magnetic Material: UNKNOWN; Polarized: NO; Voltage Rating: 50V; Assembly Type: SMD; CreatedBy/Date: Nicolas V. (2018-11-20); Current Rating: *; HelpURL: http://www.yageo.com/documents/recent/PYu-RC_Group_51_RoHS_L_9.pdf; Manufacturer #2: *; Note: *; Part Number #1: RC0402FR-0710KL; Part Number #2: *; Power Max: 1/16W; Temperature: -55°C ~ 155°C; VerifiedBy: Nicolas V. (2018-11-20); Supplier 1: Digi-Key; Supplier Part Number 1: 311-10.0KLRCT-ND; Cryo: UNKNOWN
TP1-TP8 = TPO_TH_ROUND_100MIL: TPO - TEST POINT ROUND TH  - 100MIL; Magnetic Material: NO; GRAMS Lib Spec: 2.8c; Cryo: UNKNOWN; Current Rating: *; Manufacturer #1: *; Manufacturer #2: *; Note: *; Power Max: *; Value: *; Part Number #1: *; Part Number #2: *; HelpURL: *; Polarized: *; Supplier 1: *; Assembly Type: NONE; Supplier Part Number 1: *; Package: 100 MIL round; CreatedBy/Date: Louis-Daniel Gaulin/ 14/01/2020; Temperature: *; Tolerance: *; VerifiedBy: C.Paulin - 21/01/2020; Voltage Rating: *
U1 = REG_SWR_XCL214B333DR: REG_DC DC CONVERTER 3.3V 5W_9-PowerTFQFN; Manufacturer #1: Torex Semiconductor Ltd; Voltage Rating: 2.7V to 5.5V IN; Current Rating: 1.5A; GRAMS Lib Spec: 2.8; Magnetic Material: Unknown; Polarized: Yes; Value: 3.3V; Tolerance: *; Power Max: *; HelpURL: https://www.torexsemi.com/file/xcl213/XCL213-XCL214.pdf; CreatedBy/Date: Louis-Daniel Gaulin / 21-07-2020; VerifiedBy: Philippe Arsenault/2020-11-06; Temperature: -40°C ~ 105°C; Package: 9-PowerTFQFN; Manufacturer #2: *; Note: *; Assembly Type: SMD; Part Number #2: *; Part Number #1: XCL214B333DR; Supplier 1: Digi-Key; Supplier Part Number 1: 893-1218-1-ND; Cryo: UNKNOWN
U2 = REG_SWR_MYRGP180100W21RA: REG_DC DC CONVERTER 1.8V 1.8W_8-PowerTDFN; Manufacturer #1: Murata Power Solutions Inc.; Voltage Rating: 2.5V to 5.5V IN; Current Rating: 1A; GRAMS Lib Spec: 2.8; Magnetic Material: Unknown; Polarized: Yes; Value: 1.8V; Tolerance: *; Power Max: *; HelpURL: https://www.murata.com/products/productdata/8807036026910/MYRGP-b-w.pdf?1583754814000; CreatedBy/Date: Louis-Daniel Gaulin / 21-07-2020; VerifiedBy: Philippe Arsenault/2020-11-06; Temperature: -40°C~105°C; Package: 8-PowerTDFN; Manufacturer #2: *; Note: *; Assembly Type: SMD; Part Number #2: *; Part Number #1: MYRGP180100W21RA; Supplier 1: Digi-Key; Supplier Part Number 1: 811-MYRGP180100W21RACT-ND; Cryo: UNKNOWN

## Sheet HIVE_SIGHT_USB.SchDoc
size Tabloid; SheetNumber: 6; SheetTotal: 6; Sheet_Name: USB; Size: 11x17
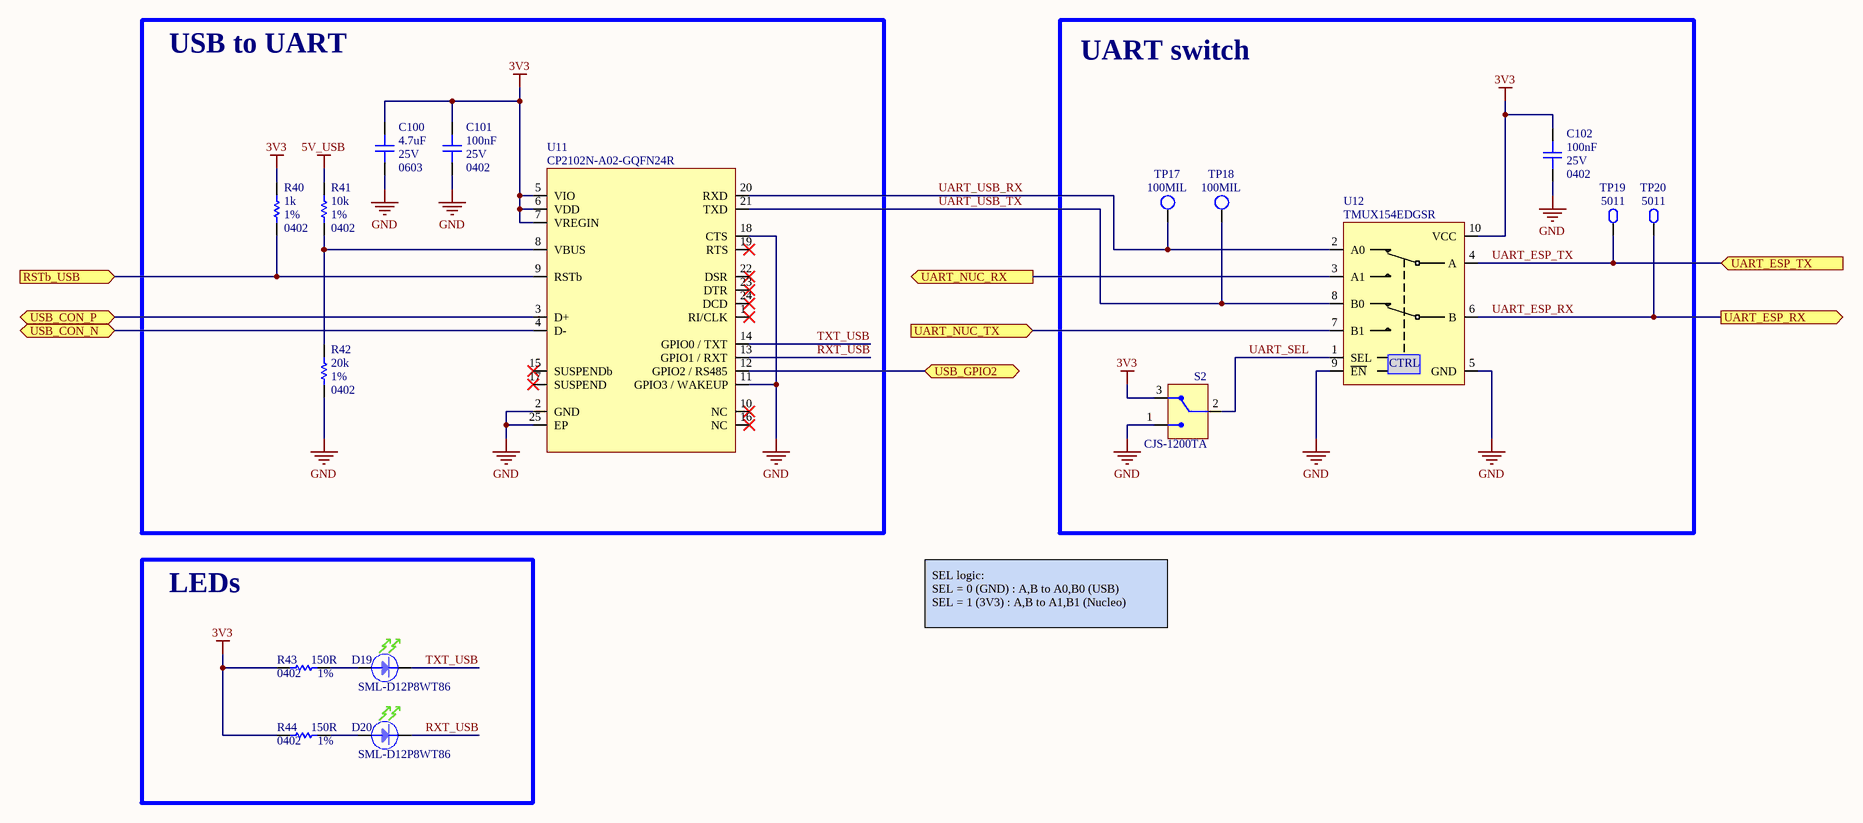
[diagram p3: HIVE_SIGHT_USB.SchDoc]

### Parts
C100  value 4.7uF  Package: 0603  Voltage Rating: 25V  [CAP_CER_0603]  (hidden comment: CL10A475MA8NQNC)
C101  value 100nF  Package: 0402  Voltage Rating: 25V  [CAP_CER_0402]  (hidden comment: CGA2B3X7R1E104K050BB)
C102  value 100nF  Package: 0402  Voltage Rating: 25V  [CAP_CER_0402]  (hidden comment: CGA2B3X7R1E104K050BB)
D19  SML-D12P8WT86  [LED_SML-D12P8WT86]
D20  SML-D12P8WT86  [LED_SML-D12P8WT86]
R40  value 1k  Tolerance: 1%  Package: 0402  [RES_0402]  (hidden comment: RC0402FR-071KL)
R41  value 10k  Tolerance: 1%  Package: 0402  [RES_0402]  (hidden comment: RC0402FR-0710KL)
R42  value 20k  Tolerance: 1%  Package: 0402  [RES_0402]  (hidden comment: RC0402FR-0720KL)
R43  value 150R  Tolerance: 1%  Package: 0402  [RES_0402]  (hidden comment: RC0402FR-07150RL)
R44  value 150R  Tolerance: 1%  Package: 0402  [RES_0402]  (hidden comment: RC0402FR-07150RL)
S2  CJS-1200TA  [SWI_SPDT_CJS-1200TA]
TP17  100MIL  [TPO_TH_ROUND_100MIL]  (no BOM)
TP18  100MIL  [TPO_TH_ROUND_100MIL]  (no BOM)
TP19  5011  [TPO_5011]
TP20  5011  [TPO_5011]
U11  CP2102N-A02-GQFN24R  [COM_XCV_CP2102N-A02-GQFN24R]
U12  TMUX154EDGSR  [LOG_MUX_TMUX154EDGSR]

### Blocks framed on the sheet
USB to UART: C100 C101 R40-R42 U11
UART switch: C102 S2 TP17-TP20 U12
LEDs: D19 D20 R43 R44

### Ports
RSTb_USB (in), UART_ESP_RX (out), UART_ESP_TX (in), UART_NUC_RX (out), UART_NUC_TX (in), USB_CON_N (bidir), USB_CON_P (bidir), USB_GPIO2 (bidir)

### Nets
3V3: C100.2 C101.2 C102.1 R40.1 R43.1 R44.1 S2.3 U11.5(VIO) U11.6(VDD) U11.7(VREGIN) U12.10(VCC)
5V_USB: R41.2
GND: C100.1 C101.1 C102.2 R42.1 S2.1 U11.2(GND) U11.11(GPIO3_/_WAKEUP) U11.18(CTS) U11.25(EP) U12.5(GND) U12.9(~{EN})
RXT_USB: D20.K U11.13(GPIO1_/_RXT)
TXT_USB: D19.K U11.14(GPIO0_/_TXT)
UART_ESP_RX: TP20.1 U12.6(B) ; port UART_ESP_RX  [project net WROOM_Rx]
UART_ESP_TX: TP19.1 U12.4(A) ; port UART_ESP_TX  [project net WROOM_Tx]
UART_SEL: S2.2 U12.1(SEL)
UART_USB_RX: TP17.1 U11.20(RXD) U12.2(A0)
UART_USB_TX: TP18.1 U11.21(TXD) U12.8(B0)
USB_D_N: U11.3(D+) ; port USB_CON_P
USB_D_P: U11.4(D-) ; port USB_CON_N
NetD19_A: D19.A R43.2
NetD20_A: D20.A R44.2
NetR40_2: R40.2 U11.9(RSTb) ; port RSTb_USB
NetR41_1: R41.1 R42.2 U11.8(VBUS)
NetU11_12: U11.12(GPIO2_/_RS485) ; port USB_GPIO2
NetU12_3: U12.3(A1) ; port UART_NUC_RX
NetU12_7: U12.7(B1) ; port UART_NUC_TX

Not connected (* = marked no-connect by the designer): U11 1(RI/CLK)* 10(NC)* 15(SUSPENDb)* 16(NC)* 17(SUSPEND)* 19(RTS)* 22(DSR)* 23(DTR)* 24(DCD)*

### Notes on the sheet
- SEL logic:
  SEL = 0 (GND) : A,B to A0,B0 (USB)
  SEL = 1 (3V3) : A,B to A1,B1 (Nucleo)
- Sheet Name
- Project Title
- Global Project
- Size
- Group
- Revision
- Date
- Sheet
- of
- Filename
- Designers
- (in symbol LOG_MUX_TMUX154EDGSR) CTRL

### Library data of the parts
C100 = CAP_CER_CL10A475MA8NQNC: as C3 on sheet HIVE_SIGHT_POWER; Assembly Type: SMD; CreatedBy/Date: Nicolas Roy 2018-11-21; Current Rating: *; HelpURL: http://www.samsungsem.com/kr/support/product-search/mlcc/__icsFiles/afieldfile/2018/06/20/CL10A475MA8NQNC.pdf; Manufacturer #2: *; Note: *; Part Number #1: CL10A475MA8NQNC; Part Number #2: *; Power Max: *; Temperature: -55°C ~ 85°C; Tolerance: 20%; VerifiedBy: Nicolas V. (2019-01-22); Supplier 1: Digi-Key; Supplier Part Number 1: 1276-1903-1-ND
C101 C102 = CAP_CER_CGA2B3X7R1E104K050BB: CAP - CER 0.1µF 10% 25V X7R - 0402; Manufacturer #1: TDK Corporation; GRAMS Lib Spec: 2.8; Magnetic Material: Unknown; Polarized: NO; Assembly Type: SMD; CreatedBy/Date: Nicolas Roy 2018-11-07; Current Rating: *; HelpURL: https://product.tdk.com/info/en/catalog/datasheets/mlcc_automotive_general_en.pdf; Manufacturer #2: *; Note: *; Part Number #1: CGA2B3X7R1E104K050BB; Part Number #2: *; Power Max: *; Temperature: -55°C ~ 125°C; Tolerance: 10%; VerifiedBy: Nicolas V. (2019-01-22); Supplier 1: Digi-Key; Supplier Part Number 1: 445-6902-1-ND
  C102: Cryo: UNKNOWN
D19 D20 = LED_SML-D12P8WT86: as D3 on sheet HIVE_SIGHT_POWER; Manufacturer #2: *; Power Max: *; Part Number #1: SML-D12P8WT86; Part Number #2: *; HelpURL: https://d1d2qsbl8m0m72.cloudfront.net/en/products/databook/datasheet/opto/led/chip_mono/sml-d12x8_d13x8-e.pdf; Supplier 1: Digi-Key; Supplier Part Number 1: 511-1579-2-ND; Assembly Type: SMD; Temperature: -40 ~ 85 °C; Package: 0603; CreatedBy/Date: Keven Deslandes - 2018/11/21; Tolerance: *; VerifiedBy: Caroline Paulin - 13 février 2019; Cryo: UNKNOWN
R40 = RES_RC0402FR-071KL: RES - 1K OHM 1% 1/16W - 0402; Manufacturer #1: Yageo; GRAMS Lib Spec: 2.8; Magnetic Material: YES; Polarized: NO; Voltage Rating: 50V; Assembly Type: SMD; CreatedBy/Date: Jonathan Bouchard 2018-07-05; Current Rating: *; HelpURL: http://www.yageo.com/documents/recent/PYu-RC_Group_51_RoHS_L_9.pdf; Manufacturer #2: *; Note: *; Part Number #1: RC0402FR-071KL; Part Number #2: *; Power Max: 1/16W; Temperature: -55°C ~ 155°C; VerifiedBy: Arnaud Samson 16-07-18; Supplier 1: Digi-Key; Supplier Part Number 1: 311-1.00KLRCT-ND
R41 = RES_RC0402FR-0710KL: as R7 on sheet HIVE_SIGHT_POWER; Assembly Type: SMD; CreatedBy/Date: Nicolas V. (2018-11-20); Current Rating: *; HelpURL: http://www.yageo.com/documents/recent/PYu-RC_Group_51_RoHS_L_9.pdf; Manufacturer #2: *; Note: *; Part Number #1: RC0402FR-0710KL; Part Number #2: *; Power Max: 1/16W; Temperature: -55°C ~ 155°C; VerifiedBy: Nicolas V. (2018-11-20); Supplier 1: Digi-Key; Supplier Part Number 1: 311-10.0KLRCT-ND; Cryo: UNKNOWN
R42 = RES_RC0402FR-0720KL: RES - 20K 1% 1/16W  - 0402; Manufacturer #1: Yageo; GRAMS Lib Spec: 2.8; Magnetic Material: Unknown; Polarized: No; Voltage Rating: 50V; Assembly Type: SMD; CreatedBy/Date: Keven Deslandes 2018-10-18; Current Rating: *; HelpURL: http://www.yageo.com/documents/recent/PYu-RC_Group_51_RoHS_L_10.pdf; Manufacturer #2: *; Note: *; Part Number #1: RC0402FR-0720KL; Part Number #2: *; Power Max: 1/16W; Temperature: -55°C ~ 155°C; VerifiedBy: Caroline Paulin - 7 janv 2019; Supplier 1: Digi-Key; Supplier Part Number 1: 311-20.0KLRCT-ND; Cryo: UNKNOWN
R43 R44 = RES_RC0402FR-07150RL: as R3 on sheet HIVE_SIGHT_POWER; Assembly Type: SMD; CreatedBy/Date: Jonathan Bouchard 2019-03-25; Current Rating: *; HelpURL: http://www.yageo.com/documents/recent/PYu-RC_Group_51_RoHS_L_10.pdf; Manufacturer #2: *; Part Number #1: RC0402FR-07150RL; Part Number #2: *; Power Max: 1/16W; Temperature: -55°C ~ 155°C; VerifiedBy: Nicolas V. (2019-05-02); Supplier 1: Digi-Key; Supplier Part Number 1: 311-150LRCT-ND; Cryo: UNKNOWN
S2 = SWI_SPDT_CJS-1200TA: SWI - SLIDE SPDT 100MA 6V - SMD; Manufacturer #1: Nidec Copal Electronics; GRAMS Lib Spec: 2.8; Magnetic Material: Unknown; Polarized: yes; Value: SPDT; Tolerance: -; Voltage Rating: 6V; Current Rating: 100mA; Power Max: -; HelpURL: https://www.nidec-copal-electronics.com/e/catalog/switch/cjs.pdf; CreatedBy/Date: Caroline Paulin - 15/11/2018; VerifiedBy: Nicolas V. (2018-11-16); Temperature: -40°C ~ 85°C; Package: SMD; Manufacturer #2: -; Assembly Type: SMD; Part Number #2: -; Part Number #1: CJS-1200TA; Supplier 1: Digi-Key; Supplier Part Number 1: 563-1021-1-ND
TP17 TP18 = TPO_TH_ROUND_100MIL: as TP1 on sheet HIVE_SIGHT_POWER; Current Rating: *; Manufacturer #1: *; Manufacturer #2: *; Note: *; Power Max: *; Value: *; Part Number #1: *; Part Number #2: *; HelpURL: *; Polarized: *; Supplier 1: *; Assembly Type: NONE; Supplier Part Number 1: *; Package: 100 MIL round; CreatedBy/Date: Louis-Daniel Gaulin/ 14/01/2020; Temperature: *; Tolerance: *; VerifiedBy: C.Paulin - 21/01/2020; Voltage Rating: *
TP19 TP20 = TPO_5011: as TP13 on sheet HIVE_SIGHT_TOP; Current Rating: *; Manufacturer #2: *; Note: *; Power Max: *; Value: *; Part Number #1: 5011; Part Number #2: *; HelpURL: https://www.keyelco.com/userAssets/file/M65p56.pdf; Assembly Type: TH; Package: *; CreatedBy/Date: Louis-Daniel Gauli / 02-11-2020; Temperature: *; Tolerance: *; VerifiedBy: Philippe Arsenault/2020-11-06; Voltage Rating: *; Cryo: UNKNOWN; Supplier 1: Digi-Key
U11 = COM_XCV_CP2102N-A02-GQFN24R: COM_XCV - IC USB TO UART BRIDGE - 24-QFN (4x4); Manufacturer #1: Silicon Labs; Voltage Rating: 3V ~ 3.6V; Current Rating: 9.5mA; Power Max: 35mW; GRAMS Lib Spec: 2.8c; Magnetic Material: Unknown; Polarized: YES; Value: -; Tolerance: -; HelpURL: https://www.silabs.com/documents/public/data-sheets/cp2102n-datasheet.pdf; CreatedBy/Date: Louis-Daniel Gaulin / 06-10-2020; VerifiedBy: Philippe Arsenault/2020-11-06; Temperature: -40°C ~ 85°C (TA); Package: 24-QFN (4x4); Manufacturer #2: -; Note: -; Assembly Type: SMD; Part Number #2: -; Part Number #1: CP2102N-A02-GQFN24R; Supplier 1: Digi-Key; Supplier Part Number 1: 336-5888-1-ND
U12 = LOG_MUX_TMUX154EDGSR: LOG_MUX -  SWITCH SPDT DUAL 2:1 - 10-VSSOP; Manufacturer #1: Texas Instruments; Voltage Rating: 3V ~ 4.3V; Current Rating: 10uA; Power Max: 50uW; GRAMS Lib Spec: 2.8C; Magnetic Material: Unknown; Polarized: YES; Value: -; Tolerance: -; HelpURL: https://www.ti.com/lit/ds/symlink/tmux154e.pdf?HQS=TI-null-null-digikeymode-df-pf-null-wwe&ts=1602037764538; CreatedBy/Date: Louis-Daniel Gaulin / 06-10-2020; VerifiedBy: Philippe Arsenault/2020-11-06; Temperature: -40°C ~ 85°C; Package: 10-VSSOP; Manufacturer #2: -; Note: -; Assembly Type: SMD; Part Number #2: -; Part Number #1: TMUX154EDGSR; Supplier 1: Digi-Key; Supplier Part Number 1: 296-48347-1-ND